# EasyEDA Pro project 12V_Distribution_PCB.eprj

# Schematic Schematic1
Board Name: Board1; Create Date: 2025-09-09; Page Name: P1; Project Name: 12V_Distribution_PCB; Schematic Name: Schematic1; Update Date: 2025-09-09; Company: EasyEDA.com; Page Size: A4; Version: V1.0
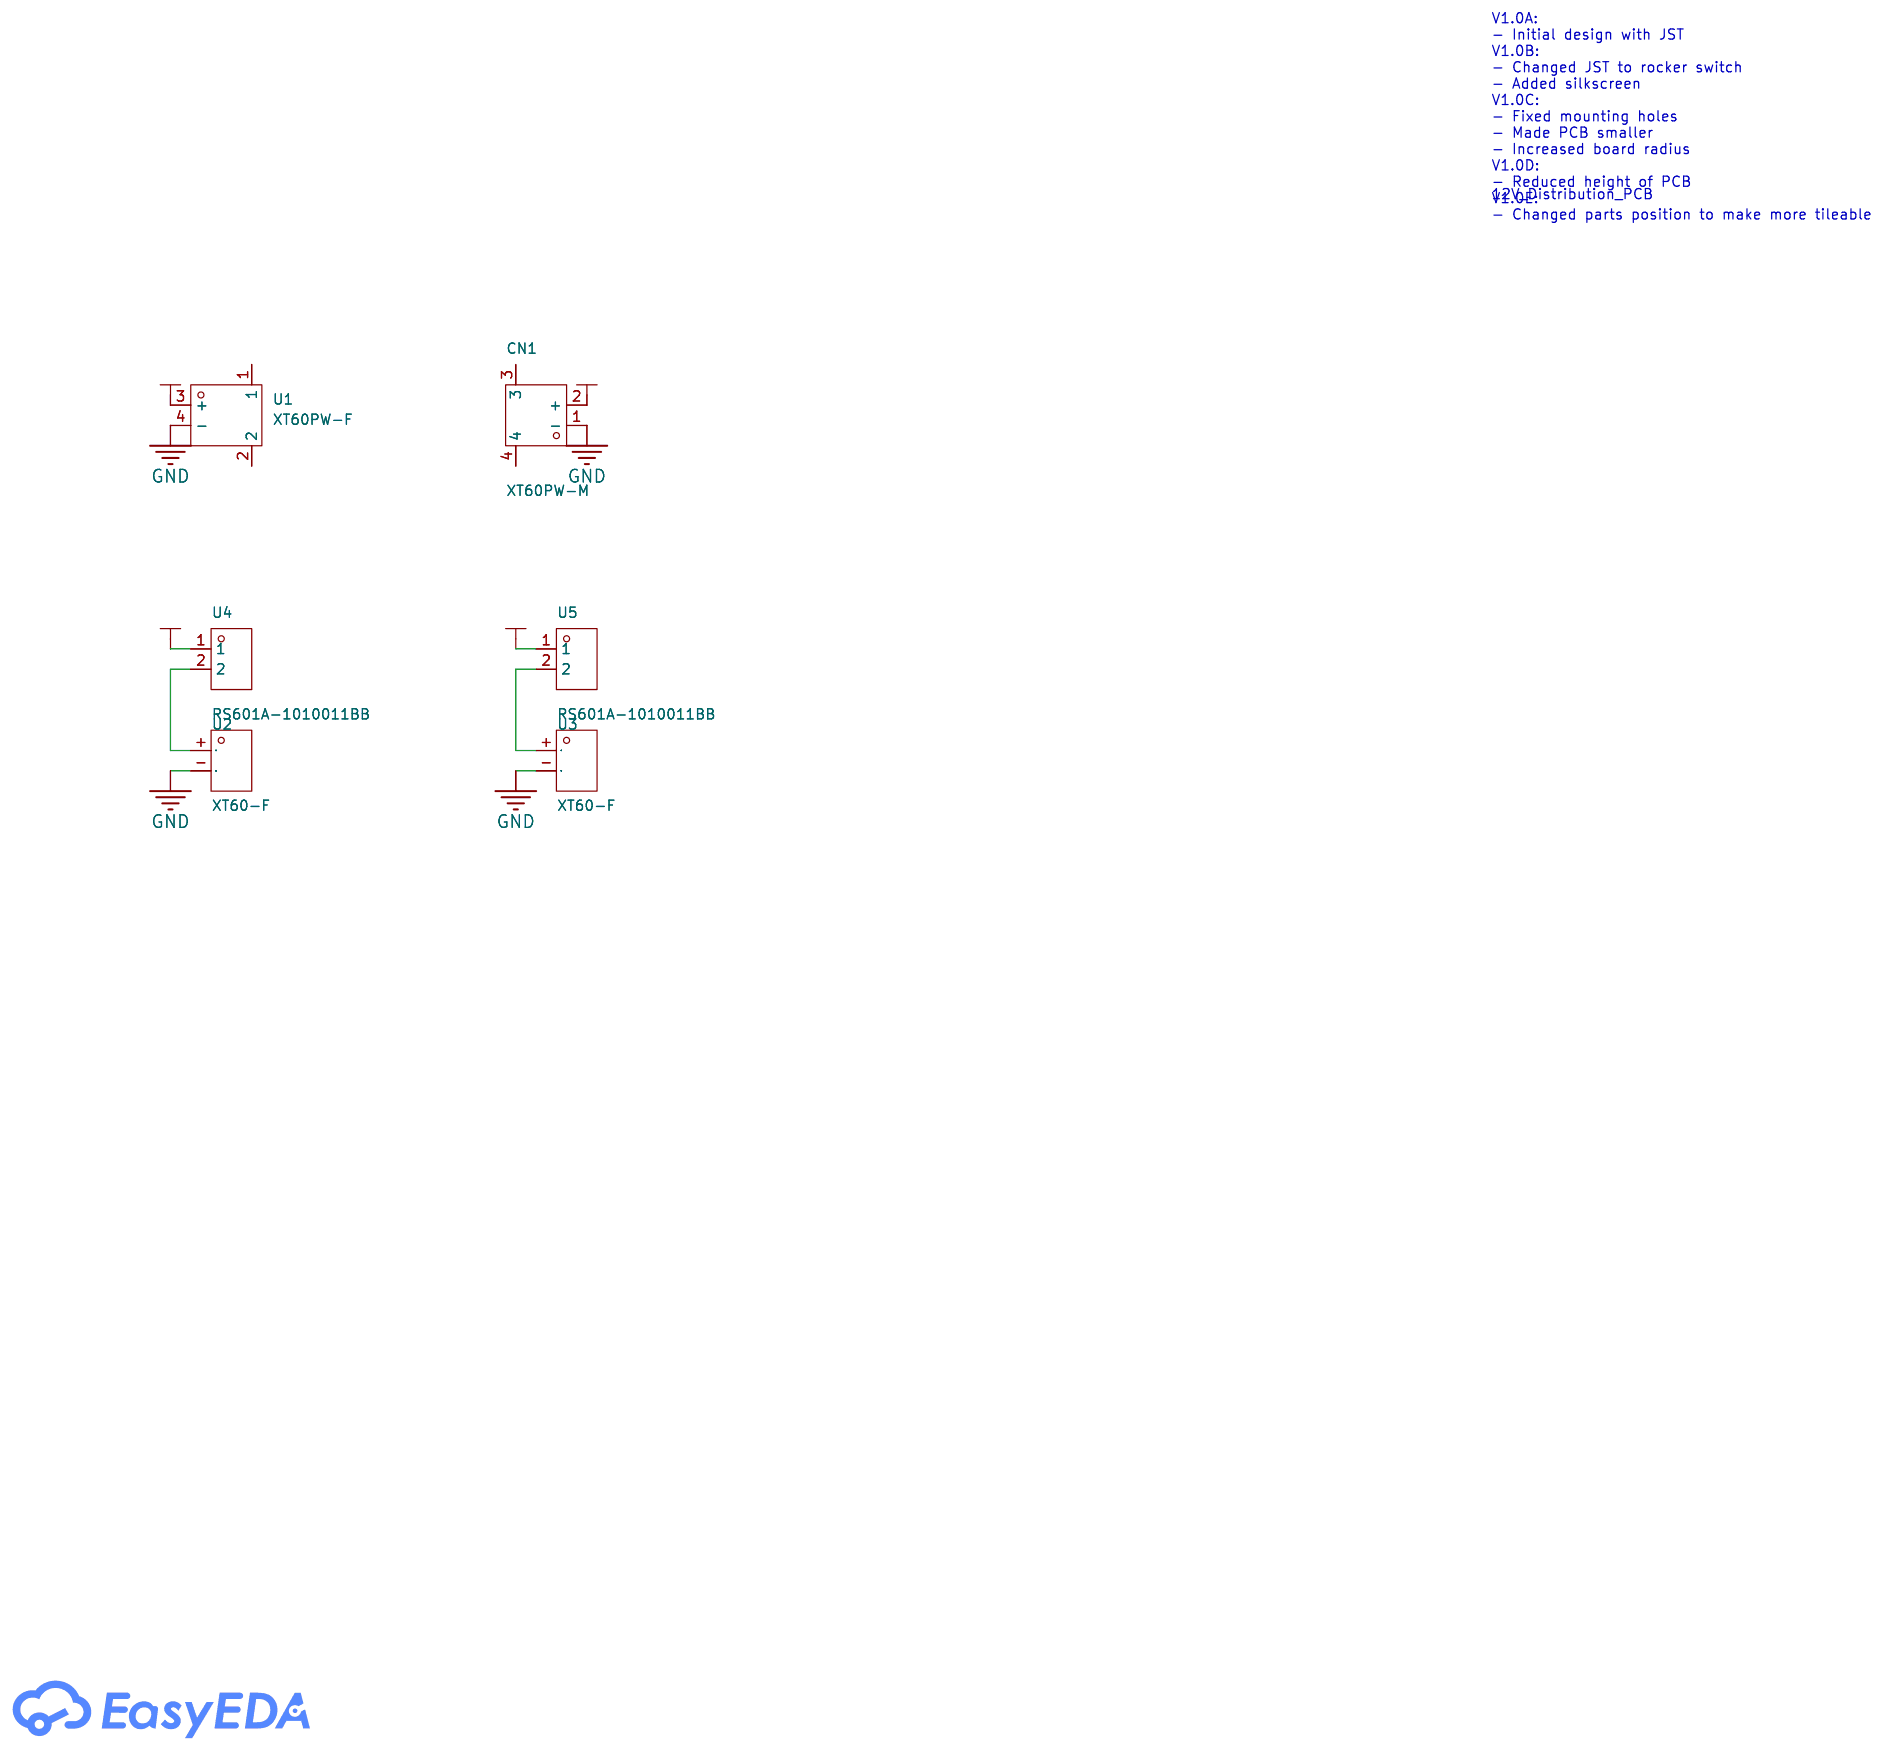
[diagram p0: schematic sheet]

## Parts
CN1  XT60PW-M  [CONN-TH_XT60PW-M]
U1  XT60PW-F  [TH_2P-XT60PW-F]
U2  XT60-F  [CONN-TH_XT60PB-F]
U3  XT60-F  [CONN-TH_XT60PB-F]
U4  RS601A-1010011BB  [SW-TH_RS601A-1010011BB]
U5  RS601A-1010011BB  [SW-TH_RS601A-1010011BB]

## Library data of the parts
CN1 = XT60PW-M: Power:- Output:- Input:- Size:- Interface:- Type:- Colour:Yellow MaximumCurrent:- Type:Horizontal plug RatedVoltage:- Type1:- NumberOfUSBHoles:- InterfaceType:Male MetalMaterial:- InsulationMaterial:- RatedCurrent:- RecommendedWireGauge:- FlameRetardantGr; LCSC Part Name: AMASS(艾迈斯)航模插头xt60连接器150公母对接pw锂电池公头 板插卧式XT60PW-M; Supplier Part: C98732; Manufacturer: AMASS(艾迈斯); JLCPCB Part Class: Extended Part; Datasheet: https://item.szlcsc.com/datasheet/XT60PW-M/99942.html; Supplier: LCSC; Type: Horizontal plug; Colour: Yellow; InterfaceType: Male
U1 = XT60PW-F: Power:- Output:- Input:- Size:- Interface:- Type:- Colour:Yellow MaximumCurrent:- Type:Horizontal plug RatedVoltage:- Type1:- NumberOfUSBHoles:- InterfaceType:Female MetalMaterial:- InsulationMaterial:- RatedCurrent:- RecommendedWireGauge:- FlameRetardant; LCSC Part Name: AMASS(艾迈斯)插头连接器锂电池组充电接口 航模电调卧式焊板 母头 XT60PW-F; Supplier Part: C428722; Manufacturer: AMASS(艾迈斯); JLCPCB Part Class: Extended Part; Datasheet: https://item.szlcsc.com/datasheet/XT60PW-F/423834.html; Supplier: LCSC; Type: Horizontal plug; Colour: Yellow; InterfaceType: Female
U2 U3 = XT60-F: Power:- Output:- Input:- Size:- Interface:- Type:- Colour:Yellow MaximumCurrent:- Type:Banana plug RatedVoltage:- Type1:- NumberOfUSBHoles:- InterfaceType:Female MetalMaterial:Gold plating InsulationMaterial:- RatedCurrent:- RecommendedWireGauge:- FlameRe; LCSC Part Name: AMASS(艾迈斯)XT60模型插头 3.5mm镀金香蕉头母头 XT60-F; Supplier Part: C98734; Manufacturer: AMASS(艾迈斯); JLCPCB Part Class: Extended Part; Datasheet: https://item.szlcsc.com/datasheet/XT60-F/99944.html; Supplier: LCSC; Type: Banana plug; Colour: Yellow; InterfaceType: Female; MetalMaterial: Gold plating
U4 U5 = RS601A-1010011BB_C2885779: Supplier Part: C2885779; Manufacturer: HCTL(华灿天禄); Supplier Footprint: 插件; JLCPCB Part Class: Extended Part; Datasheet: https://atta.szlcsc.com/upload/public/pdf/source/20210820/CD80D5B25FB294BFDCE06549B0FB3C50.pdf; Supplier: LCSC; Switch Length: 21mm; Switch Width: 15mm; Switch Height: 13.6mm; Actuator Type: Concave-Sided curved; With Lamp: None; Pin Style: Solder; Actuator Color: Black; Contact Current: 6A; Voltage Rating (AC): 250V; Circuit: SPST; Mechanical Life: 10,000 times; Operating Temperature: -25℃~+85℃; Actuator Identifier: - O

## Nets
+12V: CN1.2(+) U1.3(+) U4.1 U5.1
GND: CN1.1(-) U1.4(-) U2.-(2) U3.-(2)
$1N1471: U2.+(1) U4.2
$1N1475: U3.+(1) U5.2

Not connected (* = marked no-connect by the designer): CN1 3 4; U1 1 2

## Notes on the sheet
- 12V_Distribution_PCB
- V1.0A:
  - Initial design with JST
  V1.0B:
  - Changed JST to rocker switch
  - Added silkscreen
  V1.0C:
  - Fixed mounting holes
  - Made PCB smaller
  - Increased board radius
  V1.0D:
  - Reduced height of PCB
  V1.0E:
  - Changed parts position to make more tileable

# Board PCB1
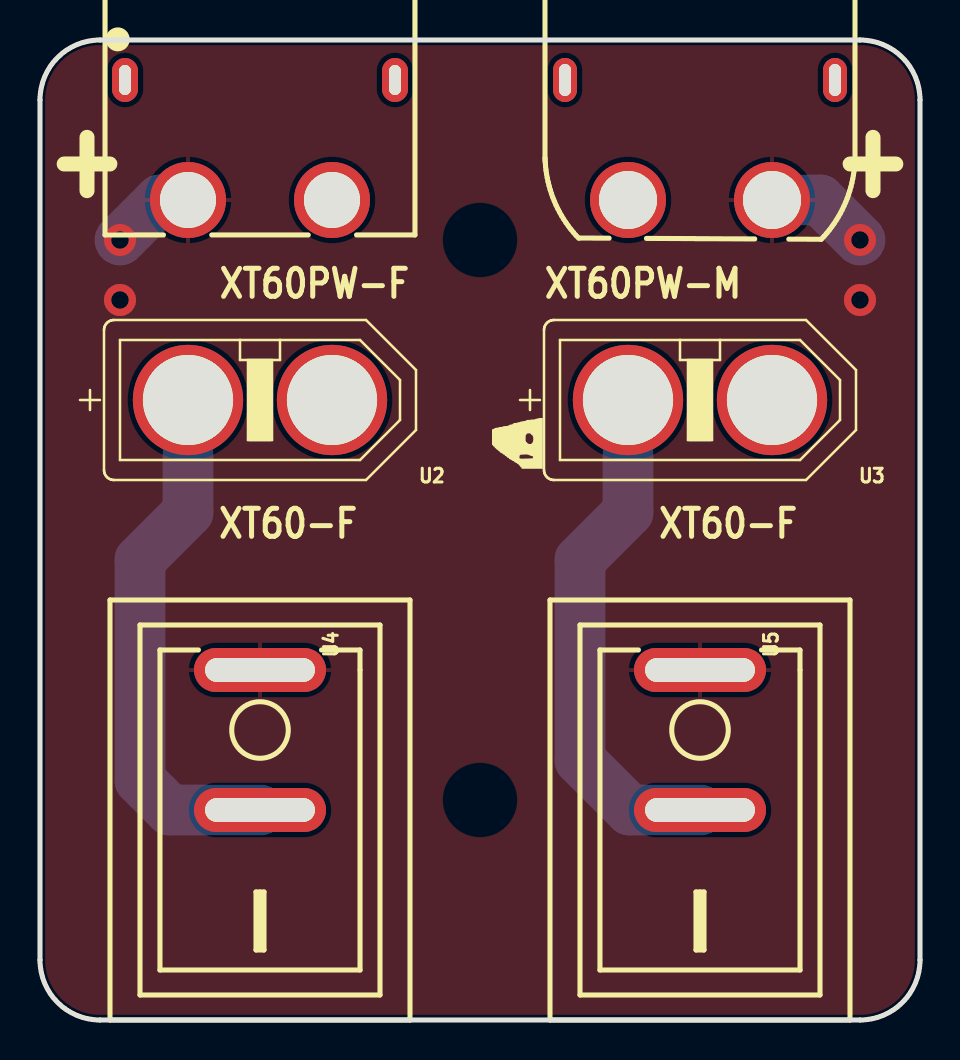
[diagram p1: board, top side]
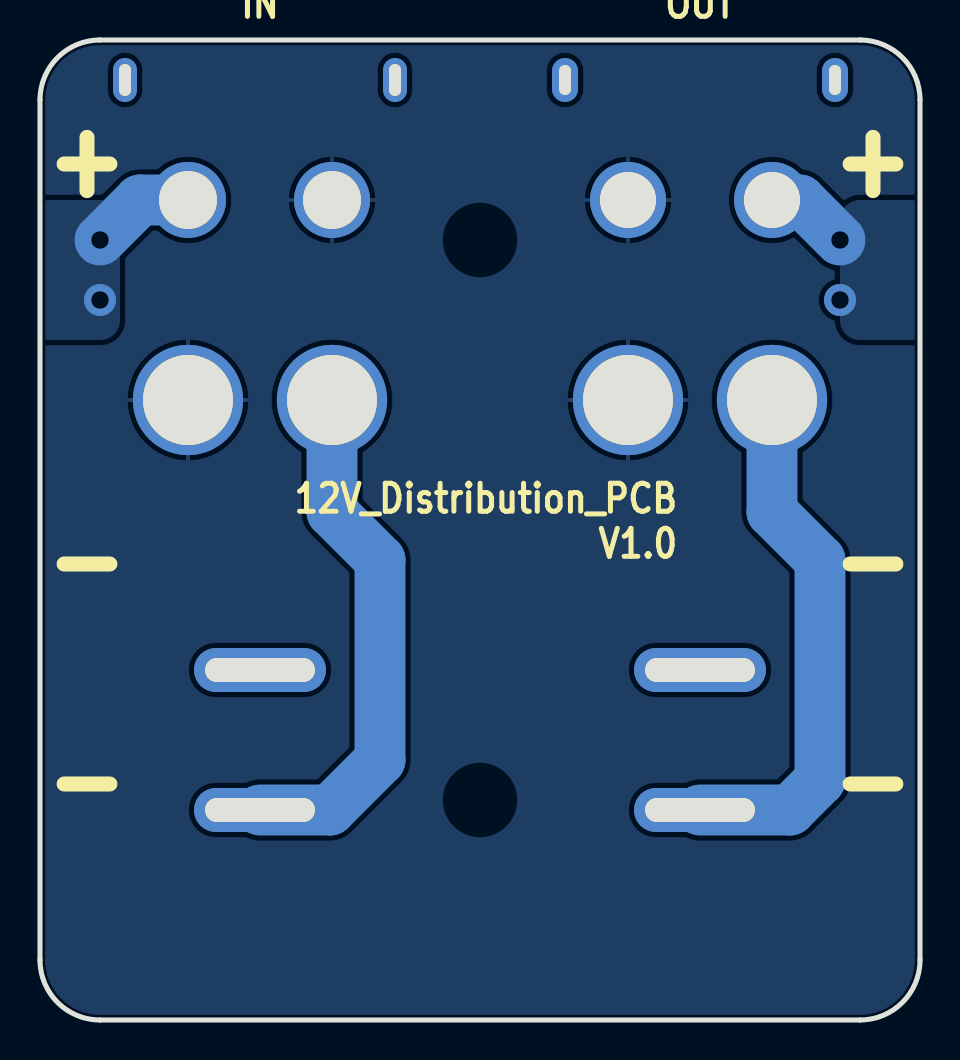
[diagram p2: board, bottom side, seen from below]

Outline 44 x 49 mm; copper layers: Top Layer, Bottom Layer. Coordinates in mm from the lower left corner of the outline.
Outline path: 0,46 0,3 arc(0.88,0.88) 3,0 41,0 arc(43.12,0.88) 44,3 44,46 arc(43.12,48.12) 41,49 3,49 arc(0.88,48.12) 0,46
Stack: Top Layer 0.035mm / Dielectric1 1.51mm FR4 er 4.5 / Bottom Layer 0.035mm

## Design rules (mm)
template: JLCPCB Capability(Two Layers Board)
spacing copperThickness1oz (default): track to track 0.102, other pairs 0.152 to 0.3
spacing copperThickness2oz: track to track 0.203, other pairs 0.152 to 0.3
track width copperThickness1oz (default): min 0.127, default 0.254, max 2.54
track width copperThickness2oz: min 0.203, default 0.254, max 2.54
differential pair differentialPair (default): width min 0.127, default 0.254, max 2.54; gap min 0.152, default 0.152
via viaSize (default): diameter min 0.5, default 0.61, max 10; hole min 0.3, default 0.305, max 6.3

## Placement (name value [footprint] x y rotation side)
CN1  XT60PW-M  [CONN-TH_XT60PW-M]  33 44 270 top
U1  XT60PW-F  [TH_2P-XT60PW-F]  11 44 0 top
U2  XT60-F  [CONN-TH_XT60PB-F]  11 31 180 top
U3  XT60-F  [CONN-TH_XT60PB-F]  33 31 180 top
U4  RS601A-1010011BB  [SW-TH_RS601A-1010011BB]  11 14 270 top
U5  RS601A-1010011BB  [SW-TH_RS601A-1010011BB]  33 14 270 top

## Footprints (pads in the part's own frame, mm; a bottom-side part is the same pattern mirrored in y, then rotated)
CONN-TH_XT60PB-F
  round 5.516 hole 4.505x4.5: +(3.6,0) -(-3.6,0)
CONN-TH_XT60PW-M
  round 3.8 hole 2.9: 1(3,-3.6) 2(3,3.6)
  oval 2.2x1.2 hole 1.6x0.6: 3(-3,6.75) 4(-3,-6.75)
SW-TH_RS601A-1010011BB
  oval 2.2x6.6 hole 1.2x5.5: 1(-3.5,0) 2(3.5,0)
TH_2P-XT60PW-F
  oval 1.3x2.2 hole 0.6x1.5: 1(-6.75,3) 2(6.75,3)
  round 3.8 hole 2.8: 3(-3.6,-3) 4(3.6,-3)

## Nets
As in the schematic.

Pads without a net: CN1 3 4; U1 1 2

## Via types
v1: diameter 1.6, hole 0.88, Top Layer to Bottom Layer, 4 vias

## Routing (per net, layer and track width the routed paths; a pad name or vN(x,y) marks a point on that pad's centre or on a via; arc(x,y) is an arc through that point)
+12V: length 9.5
  Bottom Layer w2.54: v1(41,39) 39,41 CN1.2 ; U1.3 6,41 v1(4,39)
  vias: v1(4,36) v1(41,36)
$1N1471: length 26.6
  Bottom Layer w2.54: U2.+ 7.4,25.4 5,23 5,12 6.5,10.5 U4.2
$1N1475: length 26
  Bottom Layer w2.54: U5.2 29.5,10.5 27,13 27,23 29.4,25.4 U3.+

## Copper pours and planes (outline as drawn; the poured copper is in the pictures)
+12V on Top Layer: -11.02,65.78 55.02,65.78 55.02,-5.18 -11.02,-5.18
+12V on Bottom Layer: 40,40 40.02,40.18 40.07,40.37 40.17,40.55 40.29,40.71 40.45,40.83 40.63,40.93 40.82,40.98 41,41 44,41 44.18,40.98 44.37,40.93 44.55,40.83 44.71,40.71 44.83,40.55 44.93,40.37 44.98,40.18 45,40 45,35 44.98,34.82 44.93,34.63 44.83,34.45 44.71,34.29 44.55,34.17 44.37,34.07 44.18,34.02 44,34 41,34 40.82,34.02 40.63,34.07 40.45,34.17 40.29,34.29 40.17,34.45 40.07,34.63 40.02,34.82 40,35
+12V on Bottom Layer: -1,40 -0.98,40.18 -0.93,40.37 -0.83,40.55 -0.71,40.71 -0.55,40.83 -0.37,40.93 -0.18,40.98 0,41 3,41 3.18,40.98 3.37,40.93 3.55,40.83 3.71,40.71 3.83,40.55 3.93,40.37 3.98,40.18 4,40 4,35 3.98,34.82 3.93,34.63 3.83,34.45 3.71,34.29 3.55,34.17 3.37,34.07 3.18,34.02 3,34 0,34 -0.18,34.02 -0.37,34.07 -0.55,34.17 -0.71,34.29 -0.83,34.45 -0.93,34.63 -0.98,34.82 -1,35
GND on Bottom Layer: -11.02,65.78 55.02,65.78 55.02,-5.18 -11.02,-5.18

## Text on the board
Bottom Silkscreen Layer: OUT | IN | 12V_Distribution_PCB / V1.0 | + | -
Top Silkscreen Layer: XT60-F | XT60PW-F | XT60PW-M | +
